# EasyEDA schematic sch.json
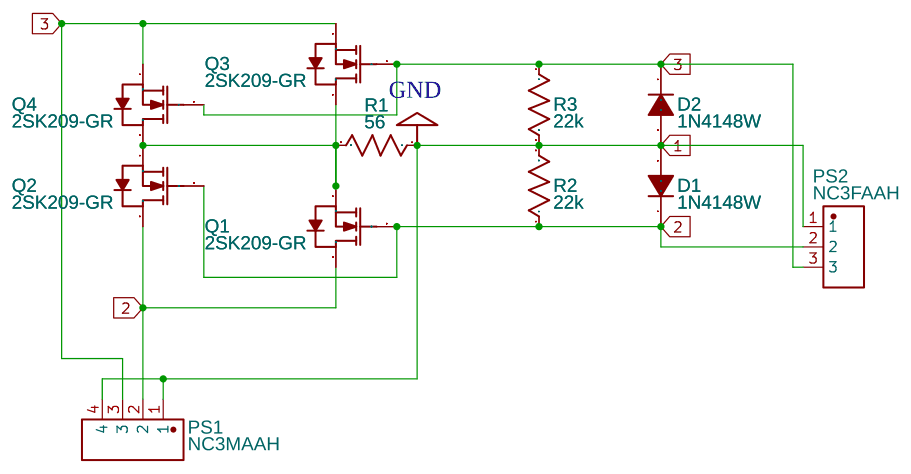
[diagram p0: schematic sheet]

## Parts
D1  1N4148W  [SOD-123_L2.8-W1.8-LS3.7-RD]
D2  1N4148W  [SOD-123_L2.8-W1.8-LS3.7-RD]
PS1  NC3MAAH  [CONN-TH_NC3MAAH]
PS2  NC3FAAH  [CONN-TH_NC3FAAH]
Q1  2SK209-GR  [SOT-23-3_L2.9-W1.6-P1.90-LS2.8-BR]
Q2  2SK209-GR  [SOT-23-3_L2.9-W1.6-P1.90-LS2.8-BR]
Q3  2SK209-GR  [SOT-23-3_L2.9-W1.6-P1.90-LS2.8-BR]
Q4  2SK209-GR  [SOT-23-3_L2.9-W1.6-P1.90-LS2.8-BR]
R1  56  [R0805]
R2  22k  [R0805]
R3  22k  [R0805]

## Library data of the parts
D1 D2 = 1N4148W-C84367: Supplier: LCSC; Manufacturer: MDD; image: //image.lceda.cn/szlcsc/C84367.jpg; Supplier Part: C84367; SMT Type: Extend; JLCPCB SMD: Yes; LCSC Assembly: Yes
PS1 = NC3MAAH: Supplier: LCSC; Supplier Part: C368463; Manufacturer: Neutrik; Contributor: LCSC; LCSC Assembly: Yes; SMT Type: Extend
PS2 = NC3FAAH: Supplier: LCSC; Supplier Part: C368521; Manufacturer: Neutrik; Contributor: LCSC; LCSC Assembly: Yes; SMT Type: Extend
Q1-Q4 = 2SK209-GR(TE85L,F): Supplier: LCSC; Manufacturer: TOSHIBA; Supplier Part: C61792; SMT Type: Extend; JLCPCB SMD: Yes; LCSC Assembly: Yes
R1-R3 = R_0805_US: Contributor: LCEDA_Lib

## Nets
1: D1.2(A) D2.2(A) PS1.1 PS1.4 PS2.1 R1.1 R2.2 R3.2
2: D1.1(C) PS1.2 PS2.2 Q1.2(D) Q1.3(G) Q2.2(D) Q2.3(G) R2.1
3: D2.1(C) PS1.3 PS2.3 Q3.1(S) Q3.3(G) Q4.1(S) Q4.3(G) R3.1
Net-(Q1-1): Q1.1(S) Q2.1(S) Q3.2(D) Q4.2(D) R1.2
